# EAGLE design main (EAGLE 7.7.0)
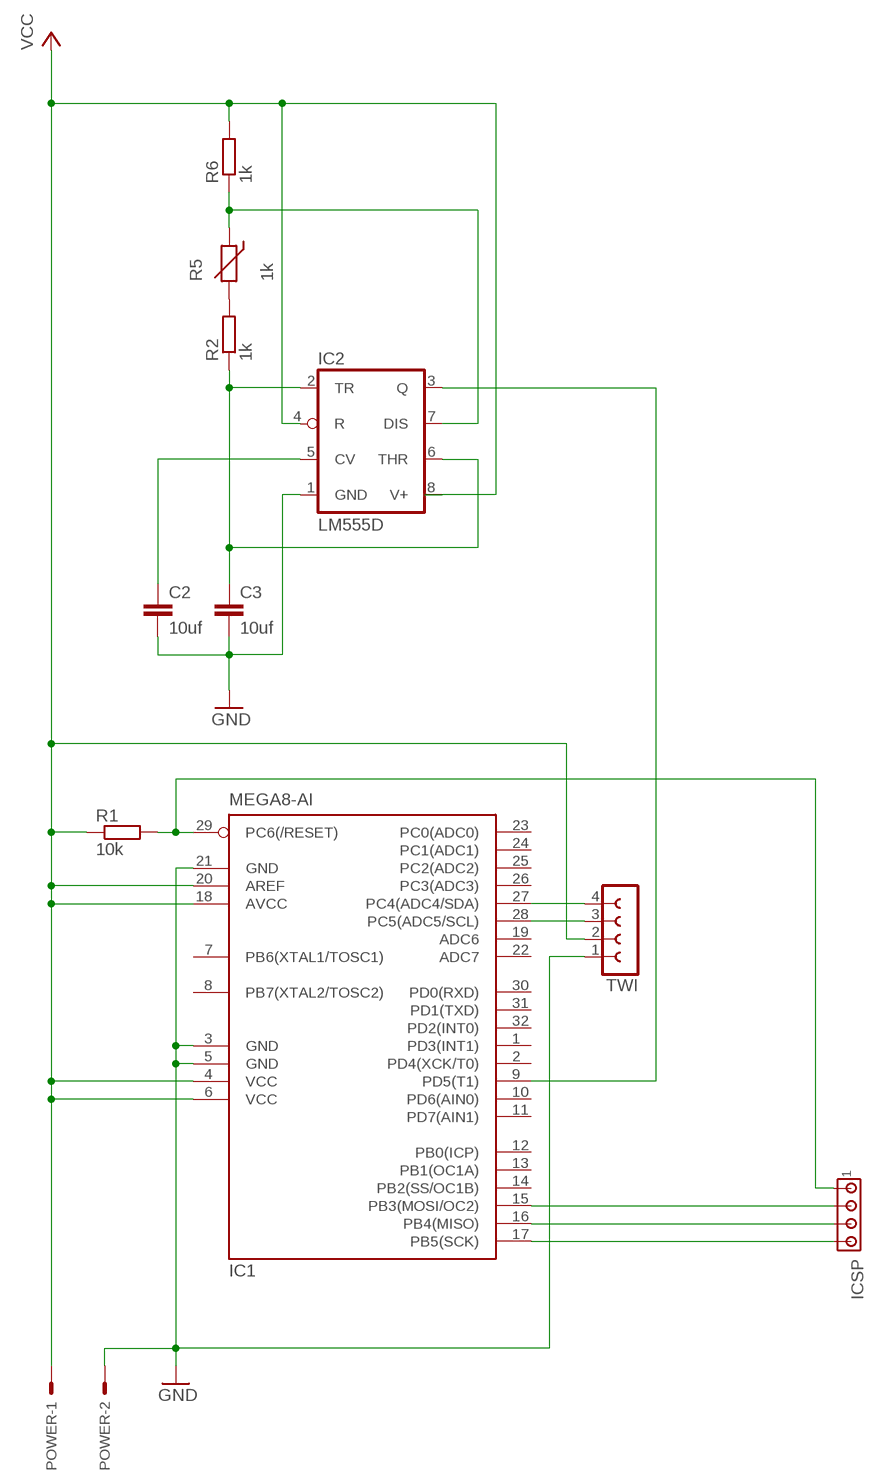
[diagram p0: schematic, sheet 1]

## Parts
C2  10uf  C-EUC2012  [C2012]
C3  10uf  C-EUC2012  [C2012]
IC1  MEGA8-AI  [TQFP32-08]
IC2  LM555D  [SO08]
ICSP  MTA04-100  [10X04MTA]
POWER  332-02  [332-02]
R1  10k  R-EU_0204/7  [0204/7]
R2  1k  R-EU_M2012  [M2012]
R5  1k  THERMISTOR-2,5  [RS-2,5]
R6  1k  R-EU_M2012  [M2012]
TWI  SPB4  [SPB4]

## Nets
GND: C2.2 C3.2 IC1.3(GND) IC1.5(GND) IC1.21(GND) IC2.1(GND) POWER.2 TWI.1
MISO: IC1.16(PB4(MISO)) ICSP.3
MOSI: IC1.15(PB3(MOSI/OC2)) ICSP.2
N$1: IC1.9(PD5(T1)) IC2.3(Q)
N$2: R2.2 R5.2
N$11: C3.1 IC2.2(TR) IC2.6(THR) R2.1
N$13: IC2.7(DIS) R5.1 R6.1
N$14: C2.1 IC2.5(CV)
RST: IC1.29(PC6(/RESET)) ICSP.1 R1.2
SCK: IC1.17(PB5(SCK)) ICSP.4
SCL: IC1.28(PC5(ADC5/SCL)) TWI.3
SDA: IC1.27(PC4(ADC4/SDA)) TWI.4
VCC: IC1.4(VCC) IC1.6(VCC) IC1.18(AVCC) IC1.20(AREF) IC2.4(R) IC2.8(V+) POWER.1 R1.1 R6.2 TWI.2
Unconnected: IC1.1(PD3(INT1)) IC1.2(PD4(XCK/T0)) IC1.7(PB6(XTAL1/TOSC1)) IC1.8(PB7(XTAL2/TOSC2)) IC1.10(PD6(AIN0)) IC1.11(PD7(AIN1)) IC1.12(PB0(ICP)) IC1.13(PB1(OC1A)) IC1.14(PB2(SS/OC1B)) IC1.19(ADC6) IC1.22(ADC7) IC1.23(PC0(ADC0)) IC1.24(PC1(ADC1)) IC1.25(PC2(ADC2)) IC1.26(PC3(ADC3)) IC1.30(PD0(RXD)) IC1.31(PD1(TXD)) IC1.32(PD2(INT0))

## Library data of the parts
C2 C3 = rcl:C-EU: CAPACITOR, European symbol
IC1 = atmel:MEGA8: MICROCONTROLLER 8 Kbytes FLASH, 1 kbytes SRAM, 512 bytes EEPROM, USART, 6-channel 10 bit ADC, 2-channel 8 bit ADC Pin compatible with Atmega48, ATMega88, ATMega168 Source: avr.lbr; MPN: ATMEGA8-16AU; OC_FARNELL: 9171371; OC_NEWARK: 73M8863
IC2 = linear:*555: TIMER
ICSP = con-amp:MTA04-100: AMP connector
POWER = con-garry:332-02: 2 Pin - 2mm Dual Row Source: www.mpe-connector.de / garry_shortform_2012.pdf
R1 R2 R6 = rcl:R-EU_: RESISTOR, European symbol
R5 = varistor:THERMISTOR: THERMISTOR
TWI = con-hirschmann:SPB4: CONNECTOR 4 pins; OC_FARNELL: unknown; OC_NEWARK: unknown

## Board
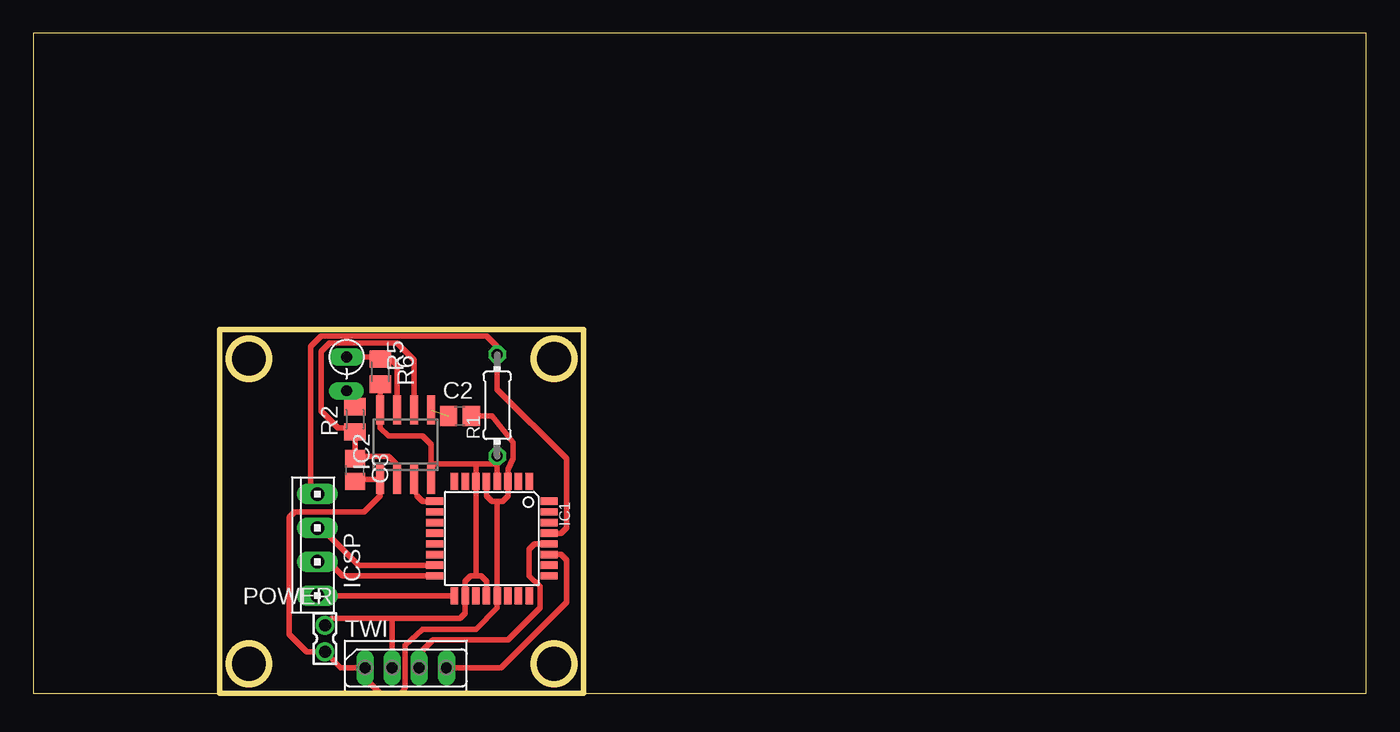
[diagram p1: board, top side]

Size 100 x 49.52 mm. Coordinates in mm from the lower left corner, seen from the top.
Outline: 41.27,0 100,0 100,49.52 0,49.52 0,0 13.97,0
Outline: 13.97,0 13.97,27.3 41.27,27.3 41.27,0
Outline: 41.27,0 13.97,0
Outline: circle at 16.17,2.2 radius 1.5
Outline: circle at 16.17,25.1 radius 1.5
Outline: circle at 39.07,25.1 radius 1.5
Outline: circle at 39.07,2.2 radius 1.5
Copper layers (1*16): Top 0.035mm / dielectric 1.5mm / Bottom 0.035mm
Design rules "default *": minimum track width 10mil, minimum drill 24mil, track to track 8mil, track to pad 8mil, pad to pad 8mil, via to via 8mil, smd to smd 8mil, copper to edge 8mil, drill to drill 8mil, minimum pad ring 10mil, minimum via ring 8mil, stop-mask expansion 4mil, vias tented up to drill 0mil, thermal gap 10mil

### Footprints (pad centres in the part's own frame; a part is rotated, then mirrored left to right if it is on the bottom)
C2012 = smd 1.3 x 1.5: 1 -0.85,0; 2 0.85,0
TQFP32-08 = smd 1.27 x 0.559: 1 -4.293,2.8; 2 -4.293,2; 3 -4.293,1.2; 4 -4.293,0.4; 5 -4.293,-0.4; 6 -4.293,-1.2; 7 -4.293,-2; 8 -4.293,-2.8; 17 4.293,-2.8; 18 4.293,-2; 19 4.293,-1.2; 20 4.293,-0.4; 21 4.293,0.4; 22 4.293,1.2; 23 4.293,2; 24 4.293,2.8 | smd 0.559 x 1.27: 9 -2.8,-4.293; 10 -2,-4.293; 11 -1.2,-4.293; 12 -0.4,-4.293; 13 0.4,-4.293; 14 1.2,-4.293; 15 2,-4.293; 16 2.8,-4.293; 25 2.8,4.293; 26 2,4.293; 27 1.2,4.293; 28 0.4,4.293; 29 -0.4,4.293; 30 -1.2,4.293; 31 -2,4.293; 32 -2.8,4.293
SO08 = smd 0.6 x 2.2: 1 -1.905,-2.6; 2 -0.635,-2.6; 3 0.635,-2.6; 4 1.905,-2.6; 5 1.905,2.6; 6 0.635,2.6; 7 -0.635,2.6; 8 -1.905,2.6
10X04MTA = drill 1.016 long: 1 3.81,0; 2 1.27,0; 3 -1.27,0; 4 -3.81,0
332-02 = drill 0.9 pad 1.27: 1 0,-1; 2 0,1
0204/7 = drill 0.813 octagon: 1 -3.81,0; 2 3.81,0
M2012 = smd 1.3 x 1.6: 1 -0.95,0; 2 0.95,0
RS-2,5 = drill 0.813 long: 1 -1.27,0; 2 1.27,0
SPB4 = drill 0.813 long: 1 -3.048,0; 2 -1.016,0; 3 1.016,0; 4 3.048,0

### Placement (x,y rotation side)
C2  32,20.8 0 top
C3  24.13,16.75 270 top
IC1  34.4,11.6 270 top
IC2  27.94,18.65 0 top
ICSP  21.31,11.12 90 top
POWER  21.88,4.09 180 top
R1  34.8,21.6 90 top
R2  24.13,20.55 90 top
R5  23.5,23.96 270 top
R6  26.04,24.13 270 top
TWI  27.94,1.91 0 top

### Tracks (layer width: path | path; a pad name or v marks a point on that pad's centre or on a via)
GND
  Top 0.406: 34.8,14.4 35.2,14.4 35.6,14.8 IC1.3 35.6,16.8 36,17.6 36,18.8 34.4,20.8 C2.2 | 34.8,14.4 34.4,14.4 34,14.8 IC1.5 | 34.8,14.4 IC1.21 34.8,6.4 33.2,4.8 29.2,4.8 27.9,3.6 27.9,0.4 27.6,0 26,0 25.2,0.8 25.2,1.6 TWI.1 23.07,1.91 POWER.2 20.5,3.1 19.2,4.4 19.2,13.2 19.6,13.6 24.8,13.6 26,14.8 26,16.02 IC2.1 24.13,16.05 C3.2
MISO
  Top 0.406: IC1.16 23.2,8.8 22.14,9.86 ICSP.3
MOSI
  Top 0.406: IC1.15 24.4,9.6 21.71,12.29 ICSP.2
N$1
  Top 0.406: IC1.9 29.2,14.4 28.8,14.8 28.57,15.24 IC2.3
N$2
  Top 0.406: R5.2 24.13,22.46 R2.2
N$11
  Top 0.406: IC2.6 28.57,25 27.3,26.27 22.23,26.27 21.59,25.64 21.59,21.19 22.86,19.92 23.82,19.92 R2.1 C3.1 24.77,17.78 26.67,17.78 27.3,17.14 IC2.2
N$13
  Top 0.406: IC2.7 27.3,24.6 26.67,25.23 26.2,25.23 R6.1 25.89,25.23 R5.1
N$14  (1 unrouted)
RST
  Top 0.406: IC1.29 39.6,12 40,12.4 40,17.6 34.8,22.8 R1.2 34.8,26 34,26.8 21.6,26.8 20.8,26 20.8,15.45 ICSP.1
SCK
  Top 0.406: IC1.17 ICSP.4
SCL
  Top 0.406: TWI.3 29.2,2.15 29.2,3.2 30,4 35.6,4 38,6.4 38,8 37.2,8.8 37.2,10.8 37.6,11.2 IC1.28
SDA
  Top 0.406: IC1.27 39.6,10.4 40,10 40,6.8 35.1,1.91 TWI.4
VCC
  Top 0.406: 33.2,8.8 32.8,8.8 32.4,8.4 IC1.18 32.4,6 32,5.6 26.8,5.6 | 33.2,8.8 33.6,8.8 34,8.4 IC1.20 | 33.2,8.8 IC1.6 33.2,17.2 | 29.84,17.2 29.84,18.65 29.21,19.29 26.67,19.29 26.04,19.92 IC2.8 26.04,23.57 R6.2 | 29.84,17.2 IC2.4 | IC1.4 34.8,17.2 | 34.8,17.2 33.2,17.2 | 33.2,17.2 29.84,17.2 | 26.8,5.6 22.39,5.6 POWER.1 | TWI.2 26.92,5.48 26.8,5.6 | 34.8,17.2 R1.1